# EAGLE design nodRelay.v1.cg2 (EAGLE 4.11)
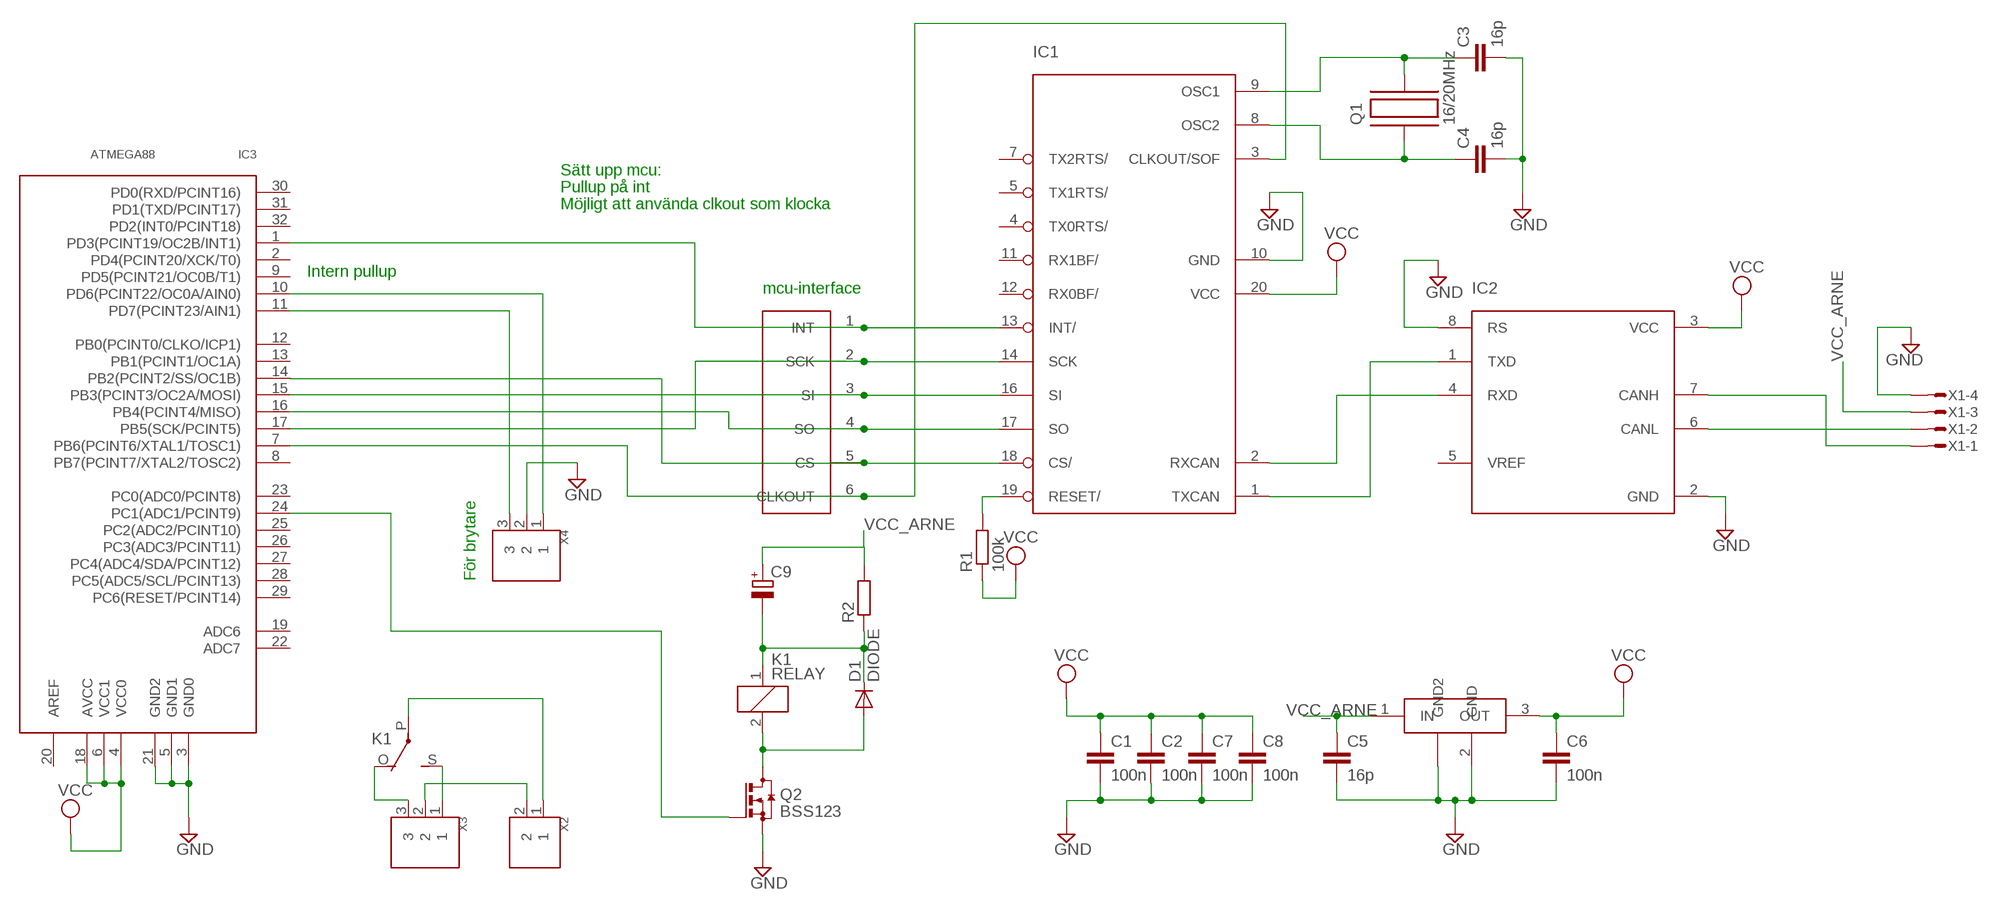
[diagram p0: schematic, sheet 1]

## Parts
C1  100n  C-EUC0603  [C0603]
C2  100n  C-EUC0603  [C0603]
C3  16p  C-EUC0603  [C0603]
C4  16p  C-EUC0603  [C0603]
C5  16p  C-EUC0603  [C0603]
C6  100n  C-EUC0603  [C0603]
C7  100n  C-EUC0603  [C0603]
C8  100n  C-EUC0603  [C0603]
C9  CPOL-EU153CLV-0807  [153CLV-0807]
D1  DIODE  [SOT23]
IC1  MCP2515  [TSSOP]
IC2  MCP2551  [TSSOP]
IC3  ATMEGA88  [TQFP32]
K1  RELAY  [TYCO-PCH]
LM340MP  LM340MP-5.0  [SOT223]
Q1  16/20MHz  C-MAC-LFA147E  [SMD]
Q2  BSS123  [SOT23]
R1  100k  R-EU_R0603  [R0603]
R2  R-EU_R1206  [R1206]
U$1  CAN-INTERFACE  [VIA-LIST]
X1  MICROMATCH-4  [MICROMATCH-4-SMD]
X2  BLOCK2  [PCB2]
X3  BLOCK3  [PCB3]
X4  BLOCK3  [PCB3]

## Nets
CANH: IC2.7(CANH) X1.1
CANL: IC2.6(CANL) X1.2
GND: C1.2 C2.2 C3.2 C4.2 C5.2 C6.2 C7.2 C8.2 IC1.10(GND) IC2.2(GND) IC2.8(RS) IC3.3(GND0) IC3.5(GND1) IC3.21(GND2) LM340MP.2(GND) LM340MP.4(GND2) Q2.2(S) X1.4 X4.2
N$1: IC1.2(RXCAN) IC2.4(RXD)
N$2: IC1.1(TXCAN) IC2.1(TXD)
N$3: X2.2 X3.2
N$4: IC1.13(INT/) IC3.1(PD3(PCINT19/OC2B/INT1)) U$1.1(INT)
N$5: K1.P(2:P) X2.1
N$6: K1.S(2:S) X3.1
N$7: K1.O(2:O) X3.3
N$8: C9.- D1.3(C) K1.1 R2.1
N$9: D1.2(A) K1.2 Q2.3(D)
N$10: IC1.19(RESET/) R1.2
N$11: IC3.11(PD7(PCINT23/AIN1)) X4.3
N$12: C3.1 IC1.9(OSC1) Q1.P$2
N$13: C4.1 IC1.8(OSC2) Q1.P$1
N$14: IC3.24(PC1(ADC1/PCINT9)) Q2.1(G)
N$15: IC3.10(PD6(PCINT22/OC0A/AIN0)) X4.1
N$20: IC1.14(SCK) IC3.17(PB5(SCK/PCINT5)) U$1.2(SCK)
N$21: IC1.16(SI) IC3.15(PB3(PCINT3/OC2A/MOSI)) U$1.3(SI)
N$22: IC1.17(SO) IC3.16(PB4(PCINT4/MISO)) U$1.4(SO)
N$23: IC1.3(CLKOUT/SOF) IC3.7(PB6(PCINT6/XTAL1/TOSC1)) U$1.6(CLKOUT)
N$29: IC1.18(CS/) IC3.14(PB2(PCINT2/SS/OC1B)) U$1.5(CS)
VCC: C1.1 C2.1 C6.1 C7.1 C8.1 IC1.20(VCC) IC2.3(VCC) IC3.4(VCC0) IC3.6(VCC1) IC3.18(AVCC) LM340MP.3(OUT) R1.1
VCC_ARNE: C5.1 C9.+ LM340MP.1(IN) R2.2 X1.3
Unconnected: IC1.4(TX0RTS/) IC1.5(TX1RTS/) IC1.7(TX2RTS/) IC1.11(RX1BF/) IC1.12(RX0BF/) IC2.5(VREF) IC3.2(PD4(PCINT20/XCK/T0)) IC3.8(PB7(PCINT7/XTAL2/TOSC2)) IC3.9(PD5(PCINT21/OC0B/T1)) IC3.12(PB0(PCINT0/CLKO/ICP1)) IC3.13(PB1(PCINT1/OC1A)) IC3.19(ADC6) IC3.20(AREF) IC3.22(ADC7) IC3.23(PC0(ADC0/PCINT8)) IC3.25(PC2(ADC2/PCINT10)) IC3.26(PC3(ADC3/PCINT11)) IC3.27(PC4(ADC4/SDA/PCINT12)) IC3.28(PC5(ADC5/SCL/PCINT13)) IC3.29(PC6(RESET/PCINT14)) IC3.30(PD0(RXD/PCINT16)) IC3.31(PD1(TXD/PCINT17)) IC3.32(PD2(INT0/PCINT18))

## Notes on the sheet
- Sätt upp mcu:
- Pullup på int
- Möjligt att använda clkout som klocka
- Intern pullup
- mcu-interface
- För brytare

## Library data of the parts
C1-C8 = rcl:C-EU: CAPACITOR, European symbol
C9 = rcl:CPOL-EU: POLARIZED CAPACITOR, European symbol
D1 = diode:DIODE: DIODE ultra fast rectifier, 3 A
IC1 = mcp2515:MCP2515
IC2 = mcp2551:MCP2551
IC3 = atmega88:ATMEGA88
K1 = relay:RELAY: RELAY 1 x switch, Omron
LM340MP = lm340mp:LM340MP-5.0
Q1 = hc49-4h-smx:C-MAC-LFA147E
Q2 = transistor-small-signal:BSS123: N-CHANNEL MOS FET
R1 R2 = rcl:R-EU_: RESISTOR, European symbol
U$1 = can-interface:CAN-INTERFACE
X1 = micromatch-smd:MICROMATCH-4: MicroMaTch 4 7-215464-4 / 0-215464-4 Drawing Number C-215464 DDEController.pdf
X2 = terminal_block:BLOCK2
X3 X4 = terminal_block:BLOCK3

## Board
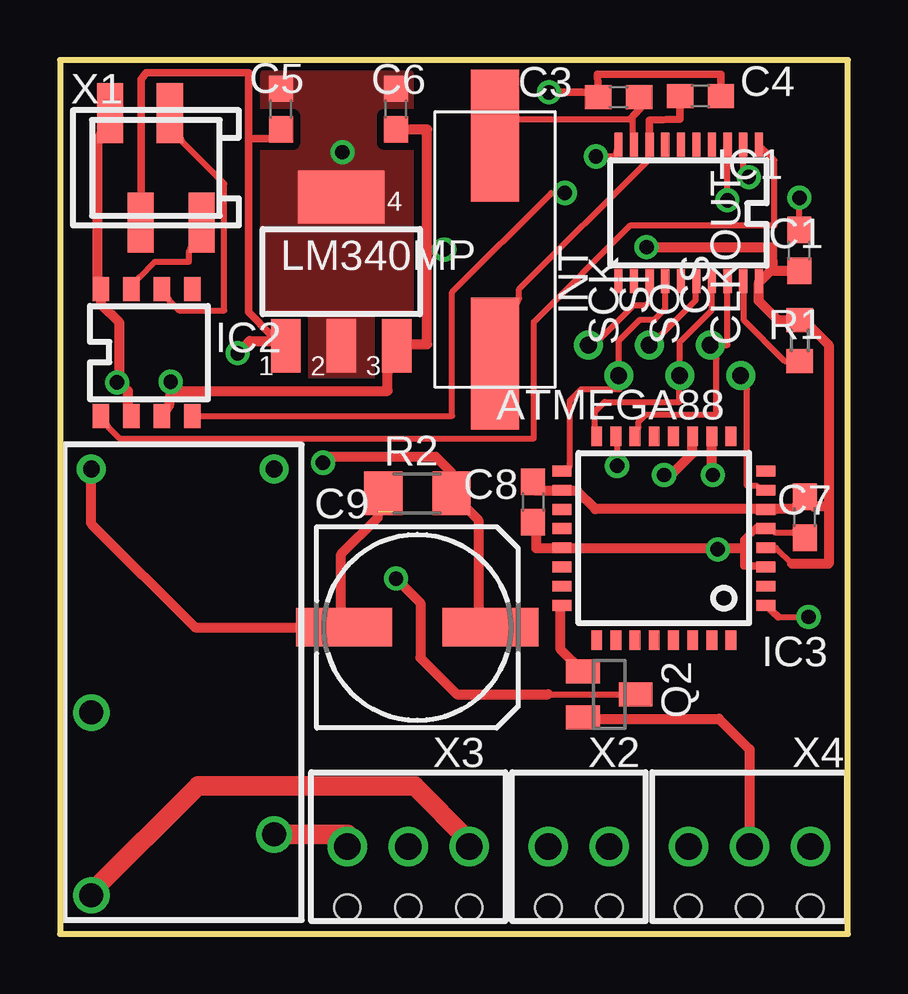
[diagram p1: board, top side]
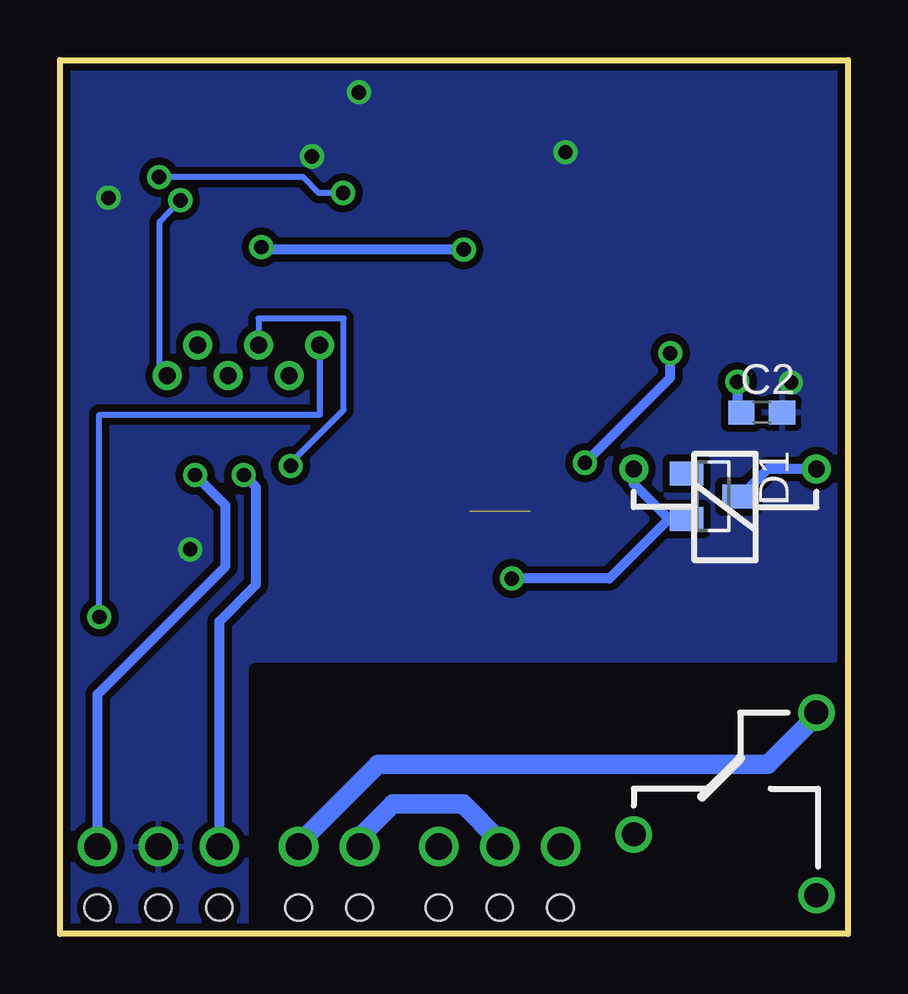
[diagram p2: board, bottom side, seen from below]

Size 32.85 x 36.43 mm. Coordinates in mm from the lower left corner, seen from the top.
Outline: 0,0 32.85,0 32.85,36.43 0,36.43 0,0
Copper layers (1*16): Top 0.035mm / dielectric 1.5mm / Bottom 0.035mm
Design rules "10mils, 0.6drill": minimum track width 10mil, minimum drill 0.6mm, track to track 10mil, track to pad 10mil, pad to pad 10mil, via to via 10mil, smd to smd 10mil, copper to edge 10mil, drill to drill 10mil, minimum pad ring 10mil, minimum via ring 8mil, stop-mask expansion 0mil, vias tented up to drill 0mil, thermal gap 10mil
tRestrict: area -0.5,-0.9 to 10.5,11; area 10.5,-0.9 to 24.4,7.4
bRestrict: area -0.5,-0.9 to 24.7,11

### Footprints (pad centres in the part's own frame; a part is rotated, then mirrored left to right if it is on the bottom)
C0603 = smd 1.1 x 1: 1 -0.85,0; 2 0.85,0
153CLV-0807 = smd 4 x 1.6: + 3.05,0; - -3.05,0
SOT23 = smd 1 x 1.4: 1 -0.95,-1.1; 2 0.95,-1.1; 3 0,1.1
TSSOP = smd 0.34 x 1: 1 -2.925,-2.85; 2 -2.275,-2.85; 3 -1.625,-2.85; 4 -0.975,-2.85; 5 -0.325,-2.85; 6 0.325,-2.85; 7 0.975,-2.85; 8 1.625,-2.85; 9 2.275,-2.85; 10 2.925,-2.85; 11 2.925,2.85; 12 2.275,2.85; 13 1.625,2.85; 14 0.975,2.85; 15 0.325,2.85; 16 -0.325,2.85; 17 -0.975,2.85; 18 -1.625,2.85; 19 -2.275,2.85; 20 -2.925,2.85
TSSOP' = smd 0.7 x 1: 1 -1.981,-2.645; 2 -0.711,-2.645; 3 0.559,-2.645; 4 1.829,-2.645; 5 1.829,2.645; 6 0.559,2.645; 7 -0.711,2.645; 8 -1.981,2.645
TQFP32 = smd 0.8 x 0.45: 1 -4.25,2.65; 2 -4.25,1.85; 3 -4.25,1.05; 4 -4.25,0.25; 5 -4.25,-0.55; 6 -4.25,-1.35; 7 -4.25,-2.15; 8 -4.25,-2.95; 17 4.25,-2.95; 18 4.25,-2.15; 19 4.25,-1.35; 20 4.25,-0.55; 21 4.25,0.25; 22 4.25,1.05; 23 4.25,1.85; 24 4.25,2.65 | smd 0.45 x 0.8: 9 -2.8,-4.4; 10 -2,-4.4; 11 -1.2,-4.4; 12 -0.4,-4.4; 13 0.4,-4.4; 14 1.2,-4.4; 15 2,-4.4; 16 2.8,-4.4; 25 2.8,4.1; 26 2,4.1; 27 1.2,4.1; 28 0.4,4.1; 29 -0.4,4.1; 30 -1.2,4.1; 31 -2,4.1; 32 -2.8,4.1
TYCO-PCH = drill 0.7 round: 1 -8.89,-3.81; 2 -8.89,3.81 | drill 1 round: O 6.35,3.81; P 1.27,-3.81; S 8.89,-3.81
SOT223 = smd 1.219 x 2.235: 1 -2.311,-3.099; 2 0,-3.099; 3 2.311,-3.099 | smd 3.6 x 2.2: 4 0,3.099
SMD = smd 5.5 x 2: P$1 4.75,0; P$2 -4.75,0
R0603 = smd 1 x 1.1: 1 -0.85,0; 2 0.85,0
R1206 = smd 1.6 x 1.803: 1 -1.422,0; 2 1.422,0
VIA-LIST = drill 0.7 round: 1 0,2.54; 2 -1.27,1.27; 3 0,0; 4 -1.27,-1.27; 5 0,-2.54; 6 -1.27,-3.81
MICROMATCH-4-SMD = smd 1.1 x 2.5: 1 1.905,-2.272; 2 0.585,2.272; 3 -0.635,-2.272; 4 -1.905,2.272
PCB2 = drill 1.1 round: 1 -2.54,0; 2 0,0 | hole 1.1: -2.54,2.54; 0,2.54
PCB3 = drill 1.1 round: 1 -2.54,0; 2 0,0; 3 2.54,0 | hole 1.1: -2.54,2.54; 0,2.54; 2.54,2.54

### Placement (x,y rotation side)
C1  30.82,28.49 90 top
C2  3.59,21.73 0 bottom
C3  23.29,34.88 180 top
C4  26.7,34.91 0 top
C5  9.22,34.38 90 top
C6  14.01,34.38 90 top
C7  31.04,17.36 270 top
C8  19.72,18 270 top
C9  14.9,12.78 0 top
D1  5.63,18.24 270 bottom
IC1  26.21,30.05 180 top
IC2  MCP2551  [TSSOP']  3.69,24.23 0 top
IC3  25.17,16.35 180 top
K1  5.12,10.49 270 top
LM340MP  11.73,27.61 0 top
Q1  18.14,28.53 270 top
Q2  22.9,9.98 270 top
R1  30.84,24.74 270 top
R2  14.9,18.36 0 top
U$1  24.57,24.55 90 top
X1  4,31.93 0 top
X2  20.36,3.63 180 top
X3  14.52,3.63 180 top
X4  28.74,3.63 180 top

### Tracks (layer width: path | path; a pad name or v marks a point on that pad's centre or on a via)
CANH
  Top 0.254: IC2.7 3.29,27.36 3.95,28.02 5.38,28.02 5.38,28.42 X1.1
CANL
  Top 0.254: IC2.6 4.56,26.39 4.97,25.99 6.85,25.99 6.85,31.27 5.12,33 X1.2
GND  (via drill 0.6)
  Top 0.254: v22.34,32.41 23.16,32.41 IC1.10 | v30.83,30.68 30.83,29.82 C1.2 | 2.48,22.99 v2.38,22.99 | 20.62,16.08 IC3.21 21.28,16.08 | 29.05,15.34 IC3.3 | 29.05,16.94 IC3.5 29.81,16.74 30.57,16.74 C7.2 | 27.27,16.08 v27.42,16.03
  Top 0.305: IC2.2 2.84,22.02 | IC2.8 1.57,27.36 | C4.2 27.56,35.84 22.4,35.84 C3.2 22.15,35.08 v20.39,35.08 | 29.05,15.34 28.51,15.34 28.51,16.08 28.51,16.41 29.05,16.94
  Top 0.406: 2.84,22.02 2.84,22.63 2.48,22.99 2.48,25.48 1.72,26.24 IC2.8 | 1.57,27.36 1.57,33 X1.4 | 20.62,16.08 19.85,16.08 19.85,17.02 C8.2 | 21.28,16.08 27.27,16.08 28.51,16.08 | X4.2 28.74,7.7 27.47,8.97 21.89,8.97 21.82,9.03 Q2.2
  Bottom 0.305: v20.39,35.08 20.34,35.03
  other vias: 11.78,32.58
  pour Bottom (isolate 0.305): -0.01,36.45 32.83,36.45 32.83,-0.03 24.38,-0.03 -0.01,-0.03
  pour Top (isolate 0.305, no thermals): 8.6,35.83 14.5,35.83 14.5,23.41 8.6,23.41
N$1  (via drill 0.6)
  Top 0.254: v21.05,30.89 20.49,30.89 16.35,26.75 16.35,21.59 5.83,21.59 IC2.4 | v28.72,31.55 28.49,31.78 IC1.2
  Bottom 0.254: v21.05,30.89 22.06,30.89 22.72,31.55 v28.72,31.55
N$2
  Top 0.254: IC2.1 2.02,21.11 2.48,20.65 19.75,20.65 19.75,25.5 23.79,29.54 29.79,29.54 29.79,32.25 IC1.1
N$3
  Bottom 0.813: X3.2 14.52,3.89 16.04,5.41 18.96,5.41 20.23,4.14 X2.2
N$4  (via drill 0.6)
  Top 0.254: U$1.1 22.25,24.55 23.92,26.21 24.43,26.21 24.58,26.37 24.58,27.08 IC1.13 | 29.94,13.21 v31.21,13.21
  Top 0.305: IC3.1 29.94,13.21
  Bottom 0.254: v31.21,13.21 31.21,21.64 22.01,21.64 22.01,24.46 22.02,24.47 U$1.1
N$5
  Bottom 0.813: X2.1 22.77,3.89 19.6,7.06 3.34,7.06 1.31,9.09 K1.P
N$6
  Top 0.813: X3.1 17.06,3.89 14.77,6.17 5.76,6.17 1.31,1.73 K1.S
N$7
  Top 0.813: K1.O 11.98,4.14 X3.3
N$8  (1 unrouted)
  Top 0.406: K1.1 1.31,17.1 5.63,12.78 C9.- 11.73,12.4 11.73,15.82 13.25,17.35 13.25,17.6 R2.1
  Bottom 0.406: D1.3 4.49,18.24 3.34,19.38 K1.1
N$9  (via drill 0.6)
  Top 0.254: 20.36,9.98 Q2.3
  Top 0.406: v14.01,14.81 15.03,13.79 15.03,11.51 16.55,9.98 20.36,9.98
  Bottom 0.406: K1.2 8.93,18.75 7.54,17.35 7.41,17.35 | D1.2 6.84,17.29 6.9,17.35 7.41,17.35 | v14.01,14.81 9.95,14.81 7.41,17.35
N$10
  Top 0.254: R1.2 30.21,23.89 28.49,25.6 28.49,27.13 28.48,27.14 IC1.19
N$11  (via drill 0.6)
  Top 0.406: v25.19,19.13 25.47,19.13 26.36,20.02 26.36,20.63 26.37,20.64 IC3.11
  Bottom 0.406: X4.3 26.2,13.03 24.68,14.56 24.68,18.62 v25.19,19.13
N$12
  Top 0.254: IC1.9 23.87,33.38 23.87,33.96 23.79,33.96 19.14,33.96 Q1.P$2
  Top 0.305: C3.1 24.17,34.4 23.79,33.96
N$13
  Top 0.254: IC1.8 24.53,32.41 24.53,32.26 19.14,26.87 19.14,26.49 Q1.P$1
  Top 0.305: IC1.8 24.58,33.92 25.85,33.95 C4.1
N$14
  Top 0.406: IC3.24 20.87,13.64 20.87,11.86 Q2.1
N$15  (via drill 0.6)
  Top 0.406: IC3.10 27.17,19.18 v27.22,19.13
  Bottom 0.406: X4.1 31.28,9.98 25.95,15.32 25.95,17.86 v27.22,19.13
N$20
  Top 0.254: IC1.14 25.23,27.17 25.19,27.13 25.24,27.08 25.24,26.06 24.78,25.6 24.17,25.6 23.29,24.73 U$1.2 23.29,23.2 23.31,22.71 21.73,22.71 21.25,22.23 21.25,19.48 IC3.17
N$21  (via drill 0.6)
  Top 0.254: U$1.3 24.64,24.55 26.51,26.42 26.51,27.18 IC1.16 | v23.23,19.51 23.23,20.35 IC3.15
  Bottom 0.254: v23.23,19.51 23.23,19.64 21.02,21.85 21.02,25.66 24.58,25.66 24.58,25.15 U$1.3
N$22
  Top 0.254: IC1.17 27.18,27.14 27.17,27.13 27.17,26.01 25.84,24.68 U$1.4 25.84,23.2 25.82,22.18 22.7,22.18 22.29,21.77 22.29,21.06 IC3.16
N$23  (via drill 0.6)
  Top 0.254: v27.83,30.58 27.83,32.41 IC1.3 | IC3.7 29.05,18.67 28.64,18.67 28.64,22.71 U$1.6
  Bottom 0.254: v27.83,30.58 28.69,29.69 28.69,23.6 U$1.6
N$29
  Top 0.254: IC1.18 27.83,24.55 U$1.5 27.37,23.98 27.37,21.64 24.43,21.64 24.12,21.34 24.12,21.11 IC3.14
VCC  (via drill 0.6)
  Top 0.254: 29.12,27.1 29.15,27.18 IC1.20 | 29.59,27.61 29.69,27.63 29.76,27.64 | 4.61,22.56 4.67,22.63 | 29.81,17.71 IC3.6 29.05,17.71 | 21.28,18.47 IC3.18 | IC3.4 29.85,16.1 30.52,15.42
  Top 0.305: 13.66,23.39 LM340MP.3
  Top 0.406: C6.1 15.31,33.53 15.31,28.53 | 15.31,28.53 15.31,24.58 14.08,24.58 14.08,24.51 LM340MP.3 | 29.12,27.1 29.12,26.39 29.93,25.59 R1.1 31.33,25.25 32.05,24.54 32.05,17.81 | 29.76,27.64 C1.1 | 29.59,27.61 29.15,27.18 | 4.67,22.63 13.66,22.63 13.66,23.39 | IC2.3 4.56,22.07 4.61,22.56 v4.61,23.01 | 15.31,28.53 v16.02,28.53 | 29.69,27.63 29.68,28.62 29.68,28.63 v24.45,28.63 | IC3.18 20.56,18.47 19.8,18.47 C8.1 | 30.52,15.42 32.05,15.42 32.05,17.81 | 32.05,17.81 31.41,17.81 C7.1 30.57,17.71 29.81,17.71 | 21.28,18.47 21.56,18.47 22.32,17.71 29.05,17.71
  Bottom 0.254: 4.61,22.23 C2.1
  Bottom 0.406: v4.61,23.01 4.61,22.23 | v24.45,28.63 24.4,28.63 24.3,28.53 v16.02,28.53
VCC_ARNE  (via drill 0.6)
  Top 0.254: 3.4,30.86 X1.3 | 7.86,33.15 7.86,33.25
  Top 0.305: C5.1 8.73,33.15 7.86,33.15 7.86,25.91 8.83,24.94 9.17,24.69 LM340MP.1 | 3.4,30.86 3.4,35.64 3.6,35.89 7.86,35.89 7.86,33.25
  Top 0.406: 17.44,12.42 C9.+ | 17.44,12.42 17.31,12.43 | 9.17,24.69 9.19,24.71 7.92,24.71 v7.41,24.21 | v10.96,19.64 11.22,19.89 15.66,19.89 16.3,19.25 16.3,18.39 R2.2 17.44,17.25 17.44,12.43 17.44,12.42
  Bottom 0.406: v10.96,19.64 7.41,23.19 v7.41,24.21

### Text on the board
tDocu: OUT | IN | BTN